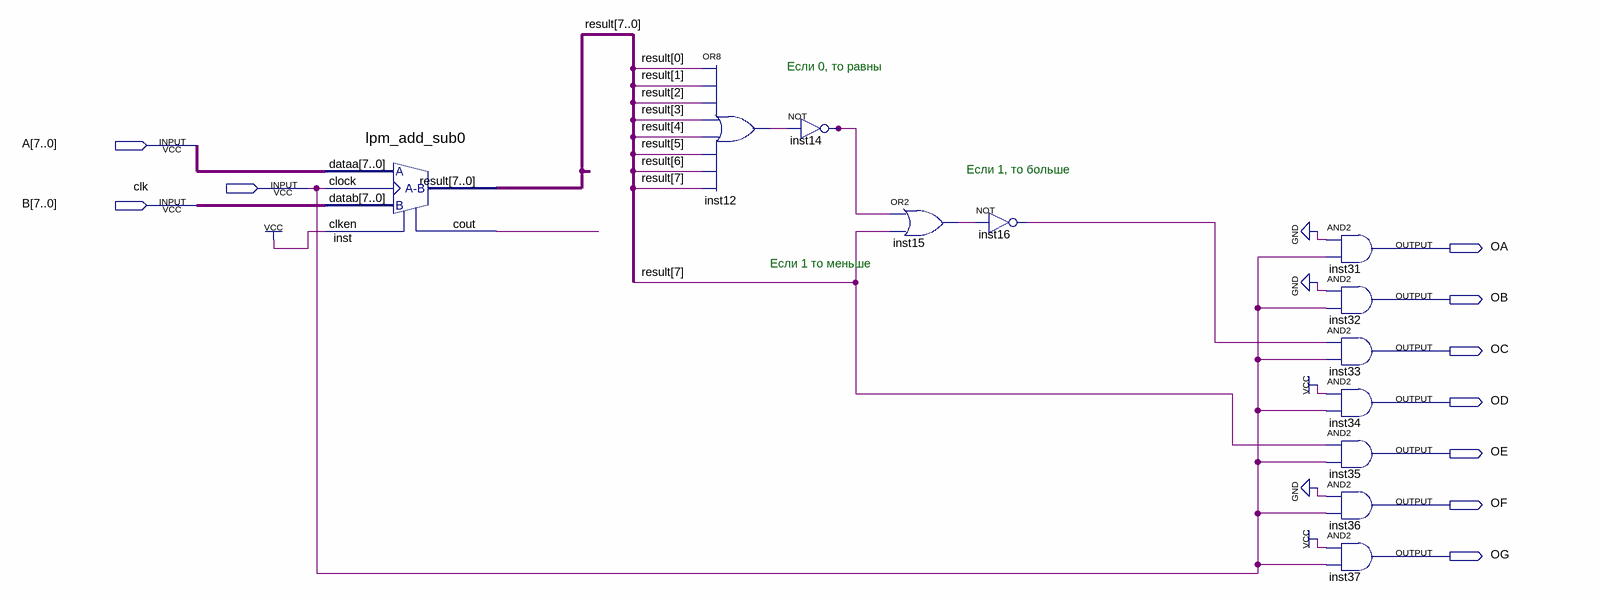
[diagram p0: schematic sheet]
// Quartus schematic LW2.bdf as structural Verilog: 12 symbols, 10 pins
module LW2 (
  input  [7:0] A,
  input  clk,
  input  [7:0] B,
  output OA,
  output OB,
  output OC,
  output OD,
  output OE,
  output OF,
  output OG
);

  wire inst12_out, inst14_out, inst15_out, inst16_out, inst_cout;
  wire [7:0] result;

  lpm_add_sub0 inst (.dataa(A), .datab(B), .clock(clk), .clken(1'b1), .result(result), .cout(inst_cout));
  or inst12 (inst12_out, result[0], result[1], result[2], result[3], result[4], result[5], result[6], result[7]);
  not inst14 (inst14_out, inst12_out);
  or inst15 (inst15_out, inst14_out, result[7]);
  not inst16 (inst16_out, inst15_out);
  and inst31 (OA, 1'b0, clk);
  and inst32 (OB, 1'b0, clk);
  and inst33 (OC, inst16_out, clk);
  and inst34 (OD, 1'b1, clk);
  and inst35 (OE, result[7], clk);
  and inst36 (OF, 1'b0, clk);
  and inst37 (OG, 1'b1, clk);

  // Notes on the sheet:
  //   Если 0, то равны
  //   Если 1, то больше
  //   Если 1 то меньше
endmodule
